# Altium schematic sheet Controle_Motor.SchDoc
size A4
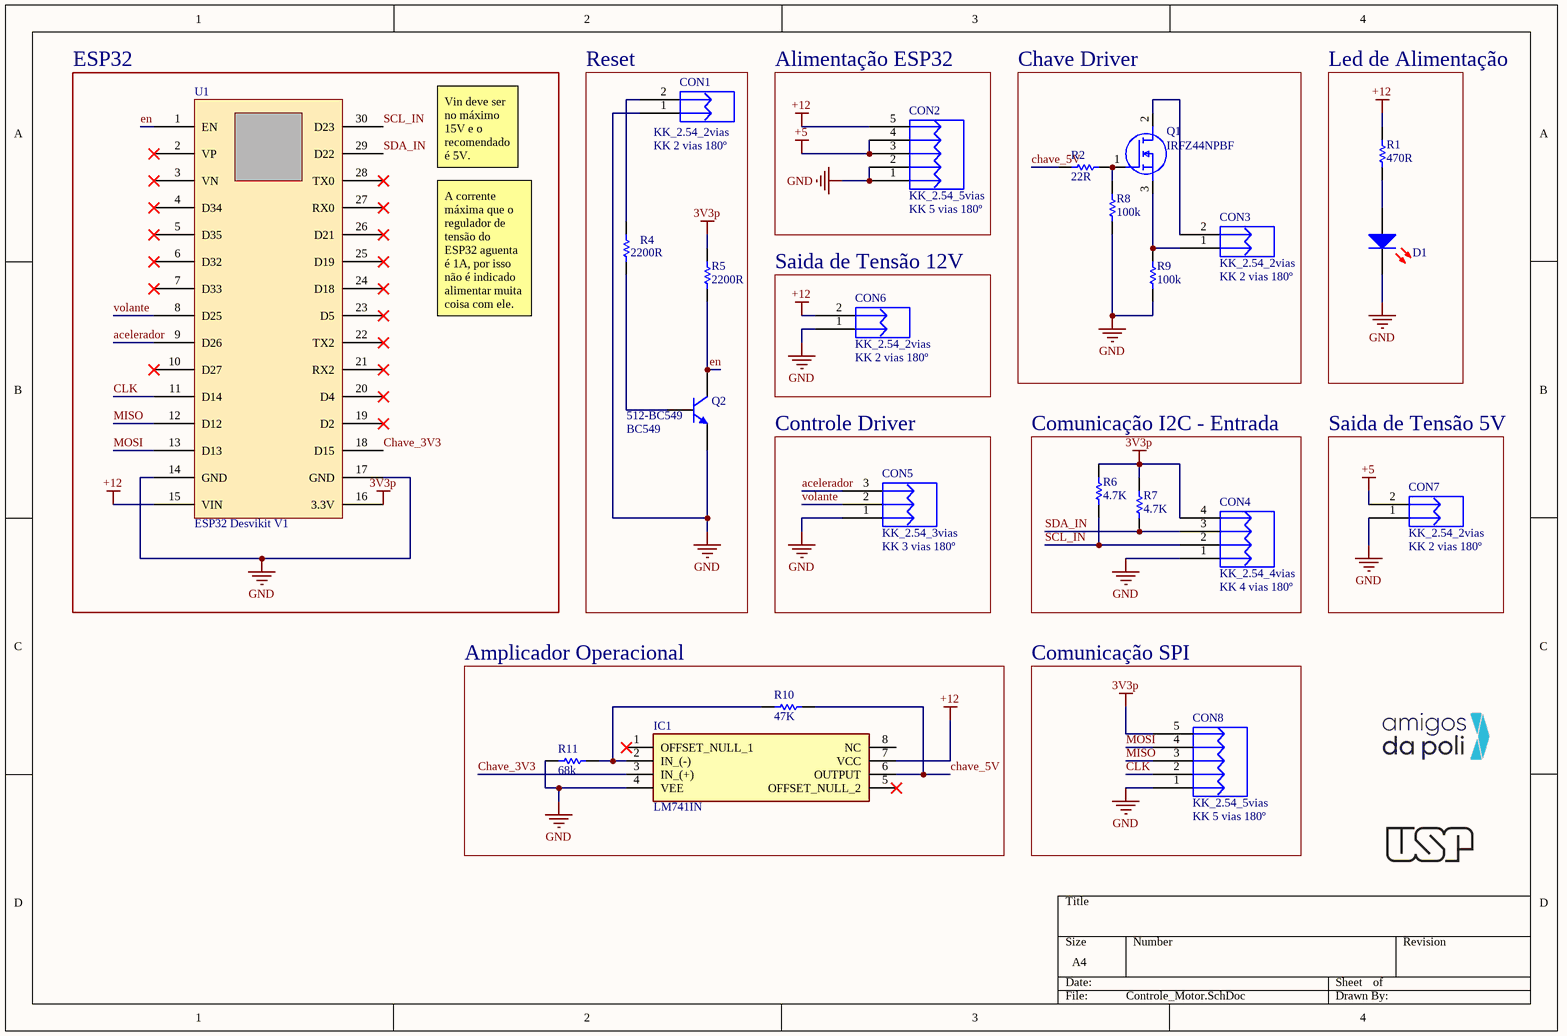
[diagram p0: Controle_Motor.SchDoc]

## Parts
CON1  KK_2.54_2vias  Valor: KK 2 vias 180º  [KK_2VIAS_180º]
CON2  KK_2.54_5vias  Valor: KK 5 vias 180º  [KK_5vias_180°]
CON3  KK_2.54_2vias  Valor: KK 2 vias 180º  [KK_2VIAS_180º]
CON4  KK_2.54_4vias  Valor: KK 4 vias 180º  [KK_4vias_180°]
CON5  KK_2.54_3vias  Valor: KK 3 vias 180º  [KK_3vias_180º]
CON6  KK_2.54_2vias  Valor: KK 2 vias 180º  [KK_2VIAS_180º]
CON7  KK_2.54_2vias  Valor: KK 2 vias 180º  [KK_2VIAS_180º]
CON8  KK_2.54_5vias  Valor: KK 5 vias 180º  [KK_5vias_180°]
D1  LED 5MM RED  [LED 5MM RED]  (value not drawn)
IC1  LM741IN  [DIP762W56P254L920H508Q8N]
Q1  IRFZ44NPBF  [TO254P483X1016X1994-3P]
Q2  BC549  Supplier Part Number 1: 512-BC549  [TO92]
R1  Resistance (Ohms): 470R  [RES 470R 1/4W CARBON FILM]  (hidden comment: RES 470R 1/4W CARBON FILM)
R2  Resistance (Ohms): 22R  [RES 470R 1/4W CARBON FILM]  (hidden comment: RES 470R 1/4W CARBON FILM)
R4  Resistance (Ohms): 2200R  [RES 470R 1/4W CARBON FILM]  (hidden comment: RES 470R 1/4W CARBON FILM)
R5  Resistance (Ohms): 2200R  [RES 470R 1/4W CARBON FILM]  (hidden comment: RES 470R 1/4W CARBON FILM)
R6  4.7K  [RES 4.7K 1/4W CARBON FILM]
R7  4.7K  [RES 4.7K 1/4W CARBON FILM]
R8  Resistance (Ohms): 100k  [RES 470R 1/4W CARBON FILM]  (hidden comment: RES 470R 1/4W CARBON FILM)
R9  Resistance (Ohms): 100k  [RES 470R 1/4W CARBON FILM]  (hidden comment: RES 470R 1/4W CARBON FILM)
R10  47K  [RES 4.7K 1/4W CARBON FILM]
R11  68k  [RES 4.7K 1/4W CARBON FILM]
U1  value ESP32 Desvikit V1  [ESP32_Desvikit_v1]  (hidden comment: microcontrolador)

## Blocks framed on the sheet
ESP32: U1
Reset: CON1 Q2 R4 R5
Alimentação ESP32: CON2
Chave Driver: CON3 Q1 R2 R8 R9
Led de Alimentação: D1 R1
Saida de Tensão 12V: CON6
Controle Driver: CON5
Comunicação I2C - Entrada: CON4 R6 R7
Saida de Tensão 5V: CON7
Amplicador Operacional: IC1 R10 R11
Comunicação SPI: CON8

## Nets
3V3p: CON4.4 CON8.5 R5.2 R6.1 R7.1 U1.16(3.3V)
+5: CON2.3 CON2.4 CON7.2
+12: CON2.5 CON6.2 IC1.7(VCC) R1.2 U1.15(VIN)
GND: CON1.1 CON2.1 CON2.2 CON4.1 CON5.1 CON6.1 CON7.1 CON8.1 D1.2(K) IC1.4(VEE) Q2.3(E) R8.1 R9.1 R11.1 U1.14(GND) U1.17(GND)
acelerador: CON5.3 U1.9(D26)
Chave_3V3: IC1.3(IN_(+)) U1.18(D15)
chave_5V: IC1.6(OUTPUT) R2.2 R10.2
CLK: CON8.2 U1.11(D14)
en: Q2.1(C) R5.1 U1.1(EN)
MISO: CON8.3 U1.12(D12)
MOSI: CON8.4 U1.13(D13)
SCL_IN: CON4.2 R6.2 U1.30(D23)
SDA_IN: CON4.3 R7.2 U1.29(D22)
volante: CON5.2 U1.8(D25)
NetCON1_2: CON1.2 R4.2
NetCON3_1: CON3.1 Q1.3(S) R9.2
NetCON3_2: CON3.2 Q1.2(D)
NetD1_1: D1.1(A) R1.1
NetIC1_2: IC1.2(IN_(-)) R10.1 R11.2
NetQ1_1: Q1.1(G) R2.1 R8.2
NetQ2_2: Q2.2(B) R4.1

Not connected (* = marked no-connect by the designer): IC1 1(OFFSET_NULL_1)* 5(OFFSET_NULL_2)* 8(NC); U1 2(VP)* 3(VN)* 4(D34)* 5(D35)* 6(D32)* 7(D33)* 10(D27)* 19(D2)* 20(D4)* 21(RX2)* 22(TX2)* 23(D5)* 24(D18)* 25(D19)* 26(D21)* 27(RX0)* 28(TX0)*

## Notes on the sheet
- Vin deve ser no máximo 15V e o recomendado é 5V.
- A corrente máxima que o regulador de tensão do  ESP32 aguenta é 1A, por isso não é indicado alimentar muita coisa com ele.

## Library data of the parts
CON1 CON3 CON6 CON7 = KK_2.54_2vias: Conector KK 2.54mm 2 vias; Descrição: Conector KK 3 vias com passo 2.54mm; Encapsulamento: PTH - 180º; Modelo: 2 vias - 180º; Marca: *; Observação: *
CON2 CON8 = KK_2.54_5vias: Conector KK 2.54mm 5 vias; Descrição: Conector KK 3 vias com passo 2.54mm; Encapsulamento: PTH - 180º; Modelo: 3 vias - 180º; Marca: *; Observação: *
CON4 = KK_2.54_4vias: Conector KK 2.54mm 4 vias; Descrição: Conector KK 3 vias com passo 2.54mm; Encapsulamento: PTH - 180º; Modelo: 3 vias - 180º; Marca: *; Observação: *
CON5 = KK_2.54_3vias: Conector KK 2.54mm 3 vias; Descrição: Conector KK 3 vias com passo 2.54mm; Encapsulamento: PTH - 180º; Modelo: 3 vias - 180º; Marca: *; Observação: *
D1 = LED 5MM RED: Manufacturer: Paralight; Manufacturer Part Number: IMP585; Bulb Size: 3mm; Wavelength Typ: 625; Forward Voltage: 2; Forward Current If: 20; Luminous Intensity: 3; LED Mounting: Through Hole; Lens Shape: Round; Viewing Angle: 60°; SVHC: No SVHC (15-Jun-2015); External Diameter: 2.9; External Length / Height: 4.6; Forward Voltage VF Max: 2.5; LED / Lamp Size: 3mm / T-1; LED Type: Standard; Lead Cross-section Depth: 0.5; Luminous Intensity @ If Min: 0.7; PIV Max: 5; Peak Forward Current: 7; Voltage Vf Typ: 2.2V<!--FANDB--><div class="features-and-benefits-container"><div class="features-and-benefits-description"><span class="features-benefits-value">The L-934LID from Kingbright is a through hole round shape high efficiency red colour LED. The device is made of gallium arsenide phosphide on gallium phosphide orange light emitting diode. This LED is widely used because of low power consumption, long life and solid state reliability.</span></div><div class="features-and-benefits-list"><ul class="features-and-benefits-list-list"><li class="features-and-benefits-list-item">Standard bulb size of T-1 (3mm)</li><li class="features-and-benefits-list-item">Reliable and rugged</li><li class="features-and-benefits-list-item">Viewing angle is 60°</li><li class="features-and-benefits-list-item">Luminous intensity of 3mcd at 2mA</li><li class="features-and-benefits-list-item">Forward voltage is 2.0V</li><li class="features-and-benefits-list-item">Forward current (If) is 20mA</li><li class="features-and-benefits-list-item">Dominant wavelength is 625nm at IF=20mA</li><li class="features-and-benefits-list-item">Peak wavelength is 627nm at IF=20; Supplier 1: Mult Comercial; RoHS: YES; Stock 1: 35260; Pricing 1: 1=0.15 (BRL); LED Colour: Red; Packaging: Each; MSL: -; Current If Luminous Intensity: 2; Dominant Wavelength: 625; Forward Current If Max: 20; Lead Cross-section Width: 0.5; Lead Spacing: 2.54; Luminous Intensity Typ: 3; Mounting Type: PCB Through Hole; No. of Pins: 2; Operating Temperature Max: 85; Operating Temperature Min: -40; Operating Temperature Range: -40°C to +85; Peak Wavelength: 625; ComponentLink1URL: http://loja.multcomercial.com.br/led-3mm-vermelho-difuso-l-314hd-paralight.html; ComponentLink1Description: http://loja.multcomercial.com.br/led-3mm-vermelho-difuso-l-314hd-paralight.html; Supplier Part Number 1: Led 3mm Vermelho Difuso L-314HD - Paralight
IC1 = LM741IN: Integrated Circuit; Manufacturer_Name: ON Semiconductor; Datasheet Link: http://www.mouser.com/datasheet/2/308/Fairchild_LM741-1191822.pdf; Height: 5.08mm; Manufacturer_Part_Number: LM741IN; Mouser Part Number: 512-LM741IN; Mouser Price/Stock: https://www.mouser.com/Search/Refine.aspx?Keyword=512-LM741IN
Q1 = IRFZ44NPBF: MOSFET (N-Channel); Manufacturer_Name: Infineon; Datasheet Link: https://www.infineon.com/dgdl/irfz44npbf.pdf?fileId=5546d462533600a40153563b3a9f220d; Height: 4.83mm; Manufacturer_Part_Number: IRFZ44NPBF; Mouser Part Number: 942-IRFZ44NPBF; Mouser Price/Stock: https://www.mouser.co.uk/ProductDetail/Infineon-IR/IRFZ44NPBF?qs=9%252BKlkBgLFf24zghzPg2f9g%3D%3D; Arrow Part Number: IRFZ44NPBF; Arrow Price/Stock: https://www.arrow.com/en/products/irfz44npbf/infineon-technologies-ag
Q2 = BC549: TRANS NPN 30V 0.1A TO-92; Manufacturer: Fairchild Semiconductor; Configuration: Single; Emitter- Base Voltage VEBO: 5 V; Collector-Emitter Saturation Voltage: 200 mV; Gain Bandwidth Product fT: 300 MHz; DC Collector/Base Gain hfe Min: 110; DC Current Gain hFE Max: 800; Maximum Power Dissipation: 0.5 W; Supplier 1: Mouser; Manufacturer Part Number: BC549; Product Category: Bipolar Transistors - BJT; RoHS: Details; Transistor Polarity: NPN; Collector- Base Voltage VCBO: 30 V; Collector- Emitter Voltage VCEO Max: 30 V; Maximum DC Collector Current: 0.1 A; Maximum Operating Temperature: + 150 C; Mounting Style: Through Hole; Package / Case: TO-92-3; Brand: Fairchild Semiconductor; Minimum Operating Temperature: - 65 C; Packaging: Bulk; Series: BC549; Factory Pack Quantity: 2000; ComponentLink1URL: https://datasheet.ciiva.com/982/bc546-982130.pdf; ComponentLink1Description: https://datasheet.ciiva.com/982/bc546-982130.pdf; ComponentLink2URL: https://datasheet.ciiva.com/17179/bc549-17179663.pdf; ComponentLink2Description: https://datasheet.ciiva.com/17179/bc549-17179663.pdf
R1 R2 R4 R5 R8 R9 = RES 470R 1/4W CARBON FILM: RES 470R OHM 1/4W 5% CARBON FILM; Manufacturer: Ty-Ohm; Manufacturer Part Number: CR25; Power (Watts): 0.25W, 1/4W; Temperature Coefficient: 0/ -500ppm/°C; Supplier 1: Mult Comercial; RoHS: RoHS Compliant; Category: Resistors; Stock 1: 617543; Pricing 1: 1=0.20 (BRL); Packaging: Cut Tape (CT); Tolerance: ±5%; Composition: Carbon Film; Features: Flame Retardant Coating, Safety; Operating Temperature: -55°C ~ 155°C; Package / Case: Axial; Supplier Device Package: Axial; Size / Dimension: 0.091" Dia x 0.256" L (2.30mm x 6.50mm); Height: -; Number of Terminations: 2; ComponentLink1URL: http://loja.multcomercial.com.br/resistor-de-1-4-de-watt-cr25-5-de-tolerancia.html; ComponentLink1Description: http://loja.multcomercial.com.br/resistor-de-1-4-de-watt-cr25-5-de-tolerancia.html; Supplier Part Number 1: Resistor de Filme de Carbono 1/4 de Watt CR25 5% de tolerância - 0.22R Ω à 10M Ω
R6 R7 R10 R11 = RES 4.7K 1/4W CARBON FILM: RES 4.7K OHM 1/4W 5% CARBON FILM; Manufacturer: Ty-Ohm; Manufacturer Part Number: CR25; Power (Watts): 0.25W, 1/4W; Temperature Coefficient: 0/ -500ppm/°C; Supplier 1: Mult Comercial; RoHS: RoHS Compliant; Category: Resistors; Stock 1: 617543; Pricing 1: 1=0.20 (BRL); Packaging: Cut Tape (CT); Tolerance: ±5%; Composition: Carbon Film; Features: Flame Retardant Coating, Safety; Operating Temperature: -55°C ~ 155°C; Package / Case: Axial; Supplier Device Package: Axial; Size / Dimension: 0.091" Dia x 0.256" L (2.30mm x 6.50mm); Height: -; Number of Terminations: 2; ComponentLink1URL: http://loja.multcomercial.com.br/resistor-de-1-4-de-watt-cr25-5-de-tolerancia.html; ComponentLink1Description: http://loja.multcomercial.com.br/resistor-de-1-4-de-watt-cr25-5-de-tolerancia.html; Supplier Part Number 1: Resistor de Filme de Carbono 1/4 de Watt CR25 5% de tolerância - 0.22R Ω à 10M Ω; Resistance (Ohms): ?
U1 = ESP32 Desvikit v1: microcontrolador com moculo bluethoth e wifi